# EasyEDA schematic table4.json
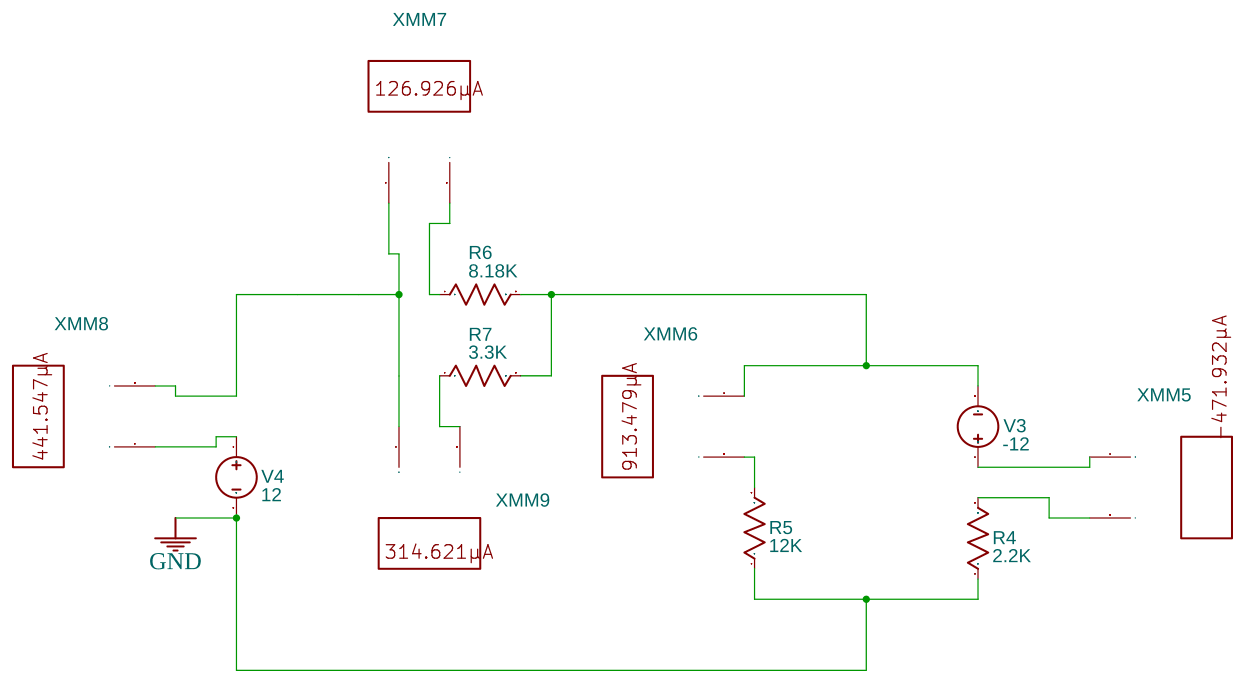
[diagram p0: schematic sheet]

## Parts
R4  2.2K  [AXIAL-0.3]
R5  12K  [AXIAL-0.3]
R6  8.18K  [AXIAL-0.3]
R7  3.3K  [AXIAL-0.3]
V3  -12  [HDR1X2]
V4  12  [HDR1X2]
XMM5  Multimeter
XMM6  Multimeter
XMM7  Multimeter
XMM8  Multimeter
XMM9  Multimeter

## Library data of the parts
R4-R7 = Resistor_US: Resistance: 1k; Contributor: EasyEDA; Supplier: YUJING
V3 V4 = VDC: Contributor: EasyEDA; sim: true
XMM5-XMM9 = MULTIMETER: Supplier: LCSC; Multimeter Type: Amper; Power Type: AC; Voltmeter resistance: 10μ; Ammeter resistance: 1G; NameDisplay: 0; Contributor: EasyEDA; sim: true

## Nets
GND: R4.1 R5.1 V4.2
Net-(R4-2): R4.2 XMM5.2(I)
Net-(R5-2): R5.2 XMM6.2(I)
Net-(R6-1): R6.1 XMM7.2(I)
Net-(R6-2): R6.2 R7.2 V3.2 XMM6.1(+)
Net-(R7-1): R7.1 XMM9.2(I)
Net-(V3-1): V3.1 XMM5.1(+)
Net-(V4-1): V4.1 XMM8.1(+)
Net-(XMM7-1): XMM7.1(+) XMM8.2(I) XMM9.1(+)
